# Altium schematic sheet con-left.SchDoc: Connector - Left
size Letter; CheckedBy: E. Chiu; CompanyName: Signal Laboratories, Inc.; DrawnBy: J. Brinton; Engineer: J. Brinton; Address1: 3479 Edison Way; Address2: Menlo Park CA 94025; Address3: +1 (877) 778-8435; Address4: brintonengineering.com; Revision: 1; SheetNumber: 22; SheetTotal: 40
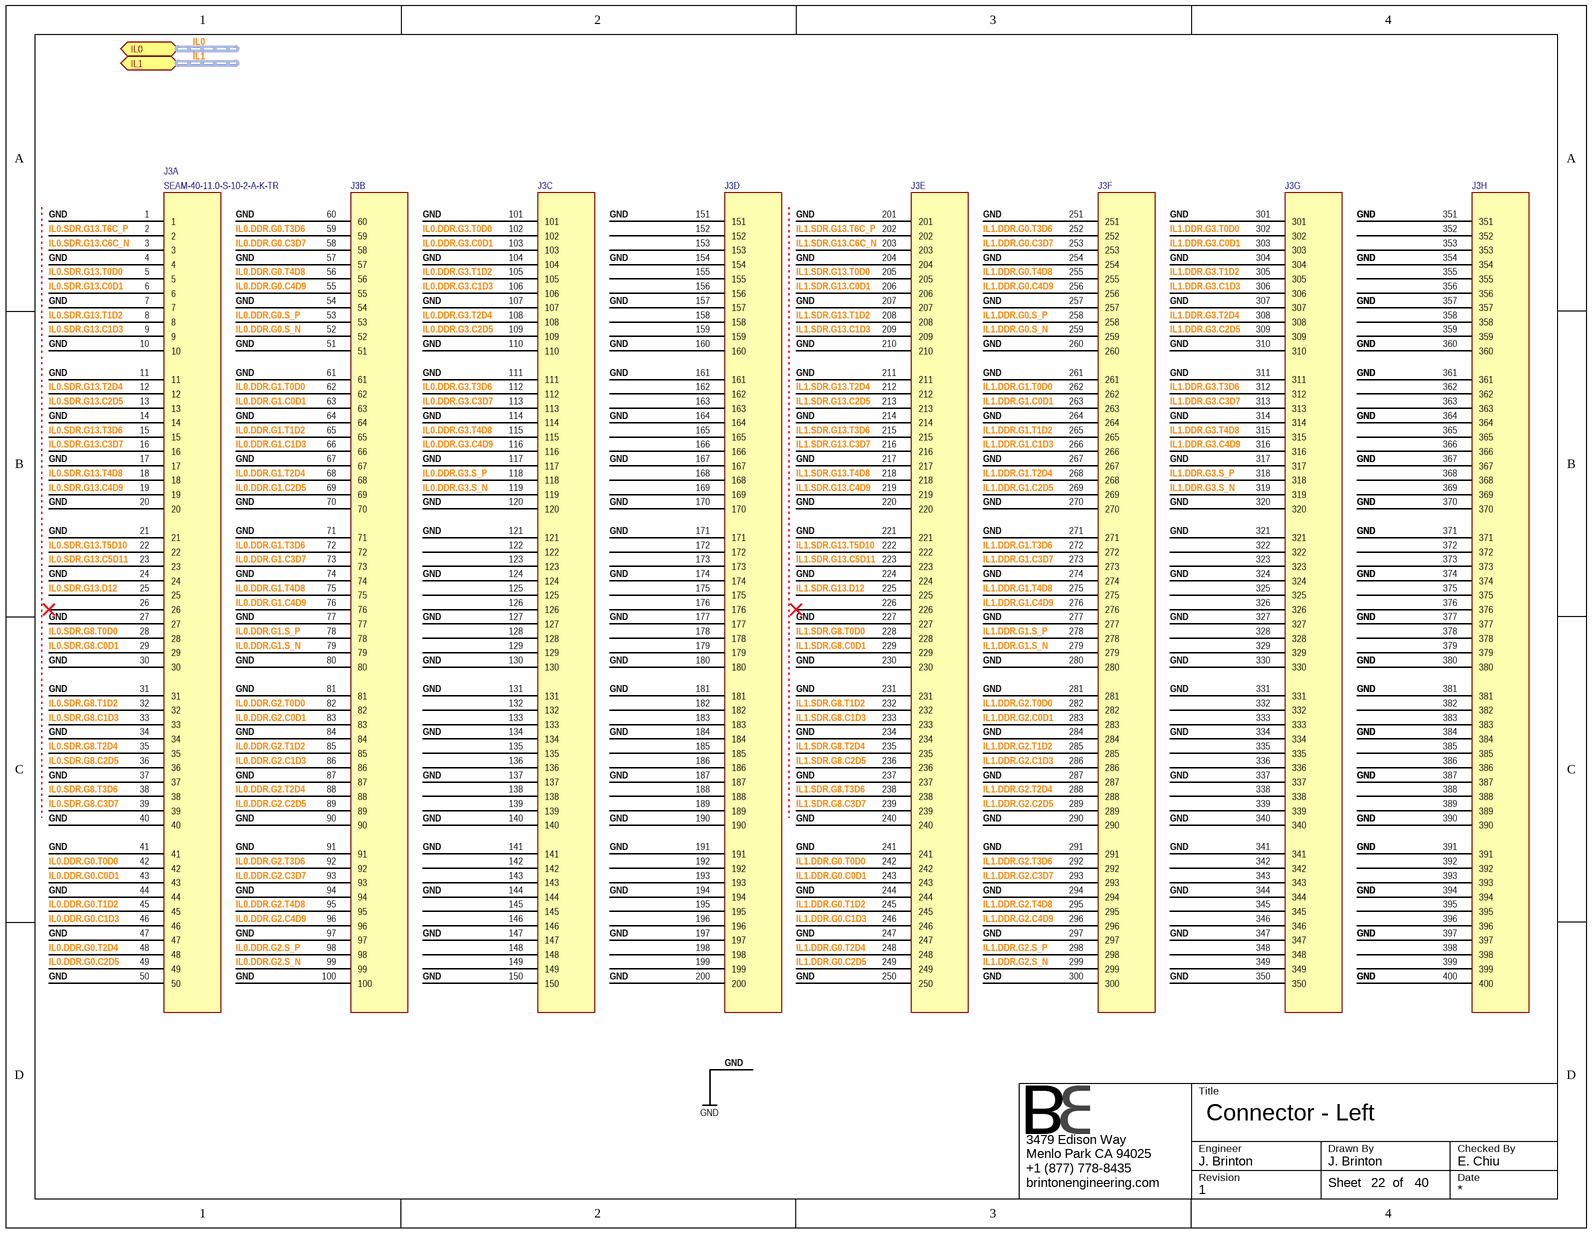
[diagram p0: con-left.SchDoc]

## Parts
J3  SEAM-40-11.0-S-10-2-A-K-TR  [SEAM-40-11.0-S-10-2-A-K-TR]  (parts A,B,C,D,E,F,G,H of 8)

## Ports
IL0 (harness IL-1V35), IL1 (harness IL-1V35)

## Nets
GND: J3.1 J3.4 J3.7 J3.10 J3.11 J3.14 J3.17 J3.20 J3.21 J3.24 J3.27 J3.30 J3.31 J3.34 J3.37 J3.40 J3.41 J3.44 J3.47 J3.50 J3.51 J3.54 J3.57 J3.60 J3.61 J3.64 J3.67 J3.70 J3.71 J3.74 J3.77 J3.80 J3.81 J3.84 J3.87 J3.90 J3.91 J3.94 J3.97 J3.100 J3.101 J3.104 J3.107 J3.110 J3.111 J3.114 J3.117 J3.120 J3.121 J3.124 J3.127 J3.130 J3.131 J3.134 J3.137 J3.140 J3.141 J3.144 J3.147 J3.150 J3.151 J3.154 J3.157 J3.160 J3.161 J3.164 J3.167 J3.170 J3.171 J3.174 J3.177 J3.180 J3.181 J3.184 J3.187 J3.190 J3.191 J3.194 J3.197 J3.200 J3.201 J3.204 J3.207 J3.210 J3.211 J3.214 J3.217 J3.220 J3.221 J3.224 J3.227 J3.230 J3.231 J3.234 J3.237 J3.240 J3.241 J3.244 J3.247 J3.250 J3.251 J3.254 J3.257 J3.260 J3.261 J3.264 J3.267 J3.270 J3.271 J3.274 J3.277 J3.280 J3.281 J3.284 J3.287 J3.290 J3.291 J3.294 J3.297 J3.300 J3.301 J3.304 J3.307 J3.310 J3.311 J3.314 J3.317 J3.320 J3.321 J3.324 J3.327 J3.330 J3.331 J3.334 J3.337 J3.340 J3.341 J3.344 J3.347 J3.350 J3.351 J3.354 J3.357 J3.360 J3.361 J3.364 J3.367 J3.370 J3.371 J3.374 J3.377 J3.380 J3.381 J3.384 J3.387 J3.390 J3.391 J3.394 J3.397 J3.400
IL0.DDR.G0.C0D1: J3.43
IL0.DDR.G0.C1D3: J3.46
IL0.DDR.G0.C2D5: J3.49
IL0.DDR.G0.C3D7: J3.58
IL0.DDR.G0.C4D9: J3.55
IL0.DDR.G0.S_N: J3.52
IL0.DDR.G0.S_P: J3.53
IL0.DDR.G0.T0D0: J3.42
IL0.DDR.G0.T1D2: J3.45
IL0.DDR.G0.T2D4: J3.48
IL0.DDR.G0.T3D6: J3.59
IL0.DDR.G0.T4D8: J3.56
IL0.DDR.G1.C0D1: J3.63
IL0.DDR.G1.C1D3: J3.66
IL0.DDR.G1.C2D5: J3.69
IL0.DDR.G1.C3D7: J3.73
IL0.DDR.G1.C4D9: J3.76
IL0.DDR.G1.S_N: J3.79
IL0.DDR.G1.S_P: J3.78
IL0.DDR.G1.T0D0: J3.62
IL0.DDR.G1.T1D2: J3.65
IL0.DDR.G1.T2D4: J3.68
IL0.DDR.G1.T3D6: J3.72
IL0.DDR.G1.T4D8: J3.75
IL0.DDR.G2.C0D1: J3.83
IL0.DDR.G2.C1D3: J3.86
IL0.DDR.G2.C2D5: J3.89
IL0.DDR.G2.C3D7: J3.93
IL0.DDR.G2.C4D9: J3.96
IL0.DDR.G2.S_N: J3.99
IL0.DDR.G2.S_P: J3.98
IL0.DDR.G2.T0D0: J3.82
IL0.DDR.G2.T1D2: J3.85
IL0.DDR.G2.T2D4: J3.88
IL0.DDR.G2.T3D6: J3.92
IL0.DDR.G2.T4D8: J3.95
IL0.DDR.G3.C0D1: J3.103
IL0.DDR.G3.C1D3: J3.106
IL0.DDR.G3.C2D5: J3.109
IL0.DDR.G3.C3D7: J3.113
IL0.DDR.G3.C4D9: J3.116
IL0.DDR.G3.S_N: J3.119
IL0.DDR.G3.S_P: J3.118
IL0.DDR.G3.T0D0: J3.102
IL0.DDR.G3.T1D2: J3.105
IL0.DDR.G3.T2D4: J3.108
IL0.DDR.G3.T3D6: J3.112
IL0.DDR.G3.T4D8: J3.115
IL0.SDR.G8.C0D1: J3.29
IL0.SDR.G8.C1D3: J3.33
IL0.SDR.G8.C2D5: J3.36
IL0.SDR.G8.C3D7: J3.39
IL0.SDR.G8.T0D0: J3.28
IL0.SDR.G8.T1D2: J3.32
IL0.SDR.G8.T2D4: J3.35
IL0.SDR.G8.T3D6: J3.38
IL0.SDR.G13.C0D1: J3.6
IL0.SDR.G13.C1D3: J3.9
IL0.SDR.G13.C2D5: J3.13
IL0.SDR.G13.C3D7: J3.16
IL0.SDR.G13.C4D9: J3.19
IL0.SDR.G13.C5D11: J3.23
IL0.SDR.G13.C6C_N: J3.3
IL0.SDR.G13.D12: J3.25
IL0.SDR.G13.T0D0: J3.5
IL0.SDR.G13.T1D2: J3.8
IL0.SDR.G13.T2D4: J3.12
IL0.SDR.G13.T3D6: J3.15
IL0.SDR.G13.T4D8: J3.18
IL0.SDR.G13.T5D10: J3.22
IL0.SDR.G13.T6C_P: J3.2
IL1.DDR.G0.C0D1: J3.243
IL1.DDR.G0.C1D3: J3.246
IL1.DDR.G0.C2D5: J3.249
IL1.DDR.G0.C3D7: J3.253
IL1.DDR.G0.C4D9: J3.256
IL1.DDR.G0.S_N: J3.259
IL1.DDR.G0.S_P: J3.258
IL1.DDR.G0.T0D0: J3.242
IL1.DDR.G0.T1D2: J3.245
IL1.DDR.G0.T2D4: J3.248
IL1.DDR.G0.T3D6: J3.252
IL1.DDR.G0.T4D8: J3.255
IL1.DDR.G1.C0D1: J3.263
IL1.DDR.G1.C1D3: J3.266
IL1.DDR.G1.C2D5: J3.269
IL1.DDR.G1.C3D7: J3.273
IL1.DDR.G1.C4D9: J3.276
IL1.DDR.G1.S_N: J3.279
IL1.DDR.G1.S_P: J3.278
IL1.DDR.G1.T0D0: J3.262
IL1.DDR.G1.T1D2: J3.265
IL1.DDR.G1.T2D4: J3.268
IL1.DDR.G1.T3D6: J3.272
IL1.DDR.G1.T4D8: J3.275
IL1.DDR.G2.C0D1: J3.283
IL1.DDR.G2.C1D3: J3.286
IL1.DDR.G2.C2D5: J3.289
IL1.DDR.G2.C3D7: J3.293
IL1.DDR.G2.C4D9: J3.296
IL1.DDR.G2.S_N: J3.299
IL1.DDR.G2.S_P: J3.298
IL1.DDR.G2.T0D0: J3.282
IL1.DDR.G2.T1D2: J3.285
IL1.DDR.G2.T2D4: J3.288
IL1.DDR.G2.T3D6: J3.292
IL1.DDR.G2.T4D8: J3.295
IL1.DDR.G3.C0D1: J3.303
IL1.DDR.G3.C1D3: J3.306
IL1.DDR.G3.C2D5: J3.309
IL1.DDR.G3.C3D7: J3.313
IL1.DDR.G3.C4D9: J3.316
IL1.DDR.G3.S_N: J3.319
IL1.DDR.G3.S_P: J3.318
IL1.DDR.G3.T0D0: J3.302
IL1.DDR.G3.T1D2: J3.305
IL1.DDR.G3.T2D4: J3.308
IL1.DDR.G3.T3D6: J3.312
IL1.DDR.G3.T4D8: J3.315
IL1.SDR.G8.C0D1: J3.229
IL1.SDR.G8.C1D3: J3.233
IL1.SDR.G8.C2D5: J3.236
IL1.SDR.G8.C3D7: J3.239
IL1.SDR.G8.T0D0: J3.228
IL1.SDR.G8.T1D2: J3.232
IL1.SDR.G8.T2D4: J3.235
IL1.SDR.G8.T3D6: J3.238
IL1.SDR.G13.C0D1: J3.206
IL1.SDR.G13.C1D3: J3.209
IL1.SDR.G13.C2D5: J3.213
IL1.SDR.G13.C3D7: J3.216
IL1.SDR.G13.C4D9: J3.219
IL1.SDR.G13.C5D11: J3.223
IL1.SDR.G13.C6C_N: J3.203
IL1.SDR.G13.D12: J3.225
IL1.SDR.G13.T0D0: J3.205
IL1.SDR.G13.T1D2: J3.208
IL1.SDR.G13.T2D4: J3.212
IL1.SDR.G13.T3D6: J3.215
IL1.SDR.G13.T4D8: J3.218
IL1.SDR.G13.T5D10: J3.222
IL1.SDR.G13.T6C_P: J3.202

Not connected (* = marked no-connect by the designer): J3 26* 122 123 125 126 128 129 132 133 135 136 138 139 142 143 145 146 148 149 152 153 155 156 158 159 162 163 165 166 168 169 172 173 175 176 178 179 182 183 185 186 188 189 192 193 195 196 198 199 226* 322 323 325 326 328 329 332 333 335 336 338 339 342 343 345 346 348 349 352 353 355 356 358 359 362 363 365 366 368 369 372 373 375 376 378 379 382 383 385 386 388 389 392 393 395 396 398 399

## Buses and harness runs
harness IL0 = port IL0
harness IL1 = port IL1

## Notes on the sheet
- Title
- Engineer
- Revision
- Drawn By
- Checked By
- Date
- Sheet
- of

## Library data of the parts
J3 = SEAM-40-11.0-S-10-2-A-K-TR: Terminal Array Assembly, Surface Mount, 0.050" Pitch, 400 Pins; Manufacturer: Samtec; Notes: SEAM(top),SEAF(bottom); Manufacturer P/N: SEAM-40-11.0-S-10-2-A-K-TR